# EAGLE design GarageDoorController-v10 (EAGLE 6.1)
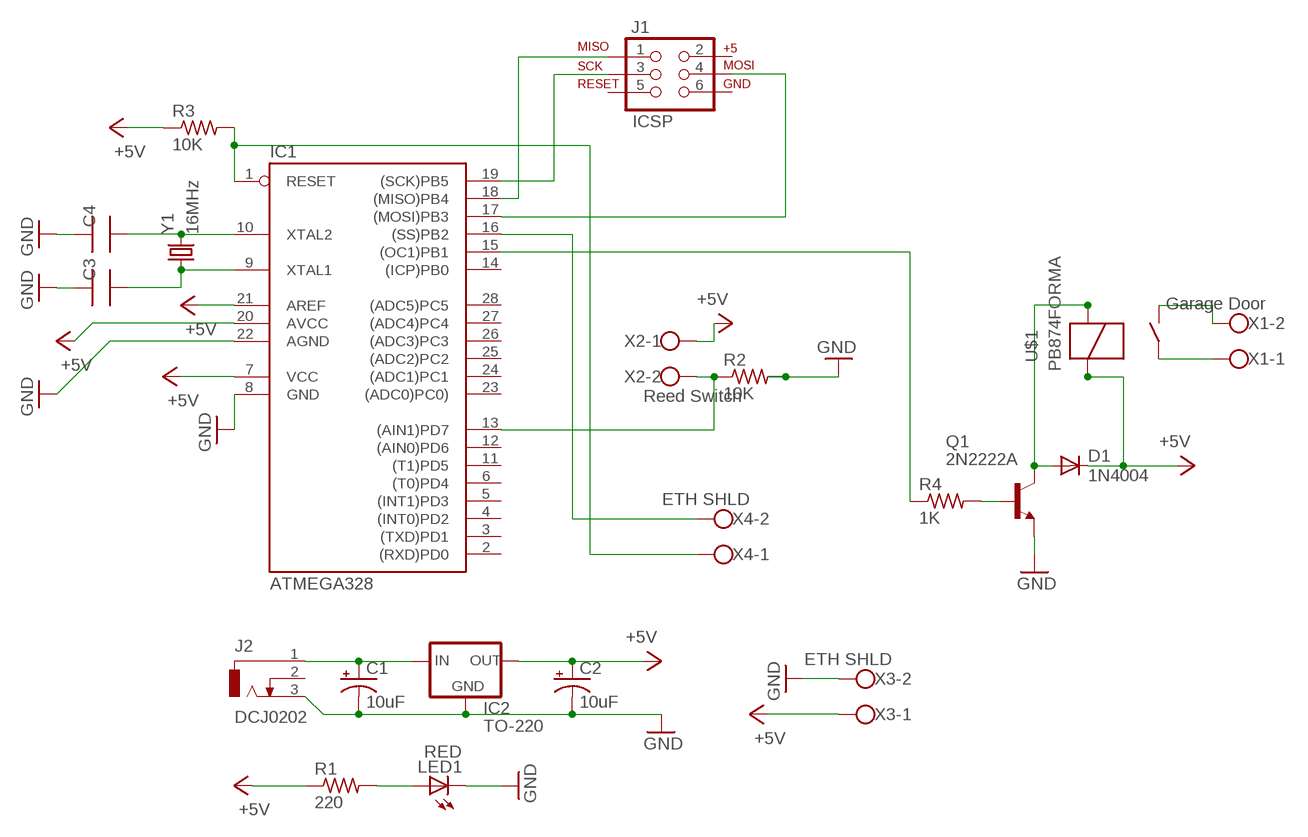
[diagram p0: schematic, sheet 1]

## Parts
C1  10uF  CPOL-USE2-5  [E2-5]
C2  10uF  CPOL-USE2-5  [E2-5]
C3  1440PH  [1440PH]
C4  1440PH  [1440PH]
D1  1N4004  [DO41-10]
IC1  ATMEGA328  AT90S4433P  [DIL28-3]
IC2  TO-220  V_REG_78XX-TO-220  [TO-220-ALT]
J1  ICSP  AVR_SPI_PRG_6PTH  [2X3]
J2  DCJ0202  [DCJ0202]
LED1  RED  LED5MM  [LED5MM]
Q1  2N2222A  [TO18]
R1  220  R-US_0204/7  [0204/7]
R2  10K  R-US_0204/7  [0204/7]
R3  10K  R-US_0204/7  [0204/7]
R4  1K  R-US_0204/7  [0204/7]
U$1  PB874FORMA  [PB874]
X1  Garage Door  W237-102  [W237-102]
X2  Reed Switch  W237-102  [W237-102]
X3  ETH SHLD  W237-102  [W237-102]
X4  ETH SHLD  W237-102  [W237-102]
Y1  16MHz  CRYSTALHC49US  [HC49US]

## Nets
+5V: C2.+ D1.C IC1.7(VCC) IC1.20(AVCC) IC1.21(AREF) IC2.OUT R1.1 R3.1 U$1.2 X2.1 X3.1
GND: C1.- C2.- C3.1 C4.1 IC1.8(GND) IC1.22(AGND) IC2.GND J2.3 LED1.K(C) Q1.1(E) R2.2 X3.2
N$1: C4.2 IC1.10(XTAL2) Y1.2
N$2: C3.2 IC1.9(XTAL1) Y1.1
N$5: C1.+ IC2.IN J2.1
N$6: LED1.A R1.2
N$7: IC1.1(RESET) R3.2 X4.1
N$8: IC1.19((SCK)PB5) J1.3
N$9: IC1.18((MISO)PB4) J1.1
N$10: IC1.17((MOSI)PB3) J1.4
N$11: Q1.2(B) R4.2
N$12: IC1.13((AIN1)PD7) R2.1 X2.2
N$13: D1.A Q1.3(C) U$1.1
N$14: U$1.4 X1.2
N$15: IC1.15((OC1)PB1) R4.1
N$16: U$1.3 X1.1
N$17: IC1.16((SS)PB2) X4.2
Unconnected: IC1.2((RXD)PD0) IC1.3((TXD)PD1) IC1.4((INT0)PD2) IC1.5((INT1)PD3) IC1.6((T0)PD4) IC1.11((T1)PD5) IC1.12((AIN0)PD6) IC1.14((ICP)PB0) IC1.23((ADC0)PC0)) IC1.24((ADC1)PC1) IC1.25((ADC2)PC2) IC1.26((ADC3)PC3) IC1.27((ADC4)PC4) IC1.28((ADC5)PC5) J1.2 J1.5 J1.6 J2.2

## Library data of the parts
C1 C2 = rcl:CPOL-US: POLARIZED CAPACITOR, American symbol
C3 C4 = domiflichi:1440PH: Capacitor Small PTH capacitor - Digikey Part #1440PH
D1 = diode:1N4004: DIODE general purpose rectifier, 1 A
IC1 = atmel:AT90S4433: MICROCONTROLLER 4 Kbytes FLASH 128 bytes SRAM 256 bytes EEPROM UART 6-channel 10 bit ADC; OC_FARNELL: unknown; OC_NEWARK: unknown
IC2 = SparkFun-PowerIC:V_REG_78XX: Voltage Regulator Standard 7805 5V regulator. IGO (Input Ground Output). Spark Fun Electronics SKU : COM-00107
J1 = SparkFun-Connectors:AVR_SPI_PRG_6: AVR ISP 6 Pin This is the reduced ISP connector for AVR programming. Common on Arduino. This footprint will take up less PCB space and can be used with a 10-pin to 6-pin adapter such as SKU: BOB-08508
J2 = con-jack:DCJ0202: DC POWER JACK Source: DCJ0202.pdf; OC_FARNELL: unknown; OC_NEWARK: unknown
LED1 = led:LED: LED OSRAM: - CHIPLED LG R971, LG N971, LY N971, LG Q971, LY Q971, LO R971, LY R971 LH N974, LH R974 LS Q976, LO Q976, LY Q976 LO Q996 - Hyper CHIPLED LW Q18S LB Q993, LB Q99A, LB R99A - SideLED LS A670, LO A670, LY A670, LG A670, LP A670 LB A673, LV A673, LT A673, LW A673 LH A674 LY A675 LS A676, LA A676, LO A676, LY A676, LW A676 LS A679, LY A679, LG A679 - Hyper Micro SIDELED® LS Y876, LA Y876, LO Y876, LY Y876 LT Y87S - SmartLED LW L88C, LW L88S LB L89C, LB L89S, LG L890 LS L89K, LO L89K, LY L89K LS L896, LA L896, LO L896, LY L896 - TOPLED LS T670, LO T670, LY T670, LG T670, LP T670 LSG T670, LSP T670, LSY T670, LOP T670, LYG T670 LG T671, LOG T671, LSG T671 LB T673, LV T673, LT T673, LW T673 LH T674 LS T676, LA T676, LO T676, LY T676, LB T676, LH T676, LSB T676, LW T676 LB T67C, LV T67C, LT T67C, LS T67K, LO T67K, LY T67K, LW E67C LS E67B, LA E67B, LO E67B, LY E67B, LB E67C, LV E67C, LT E67C LW T67C LS T679, LY T679, LG T679 LS T770, LO T770, LY T770, LG T770, LP T770 LB T773, LV T773, LT T773, LW T773 LH T774 LS E675, LA E675, LY E675, LS T675 LS T776, LA T776, LO T776, LY T776, LB T776 LHGB T686 LT T68C, LB T68C - Hyper Mini TOPLED® LB M676 - Mini TOPLED Santana® LG M470 LS M47K, LO M47K, LY M47K Source: http://www.osram.convergy.de LUXEON: - LUMILED® LXK2-PW12-R00, LXK2-PW12-S00, LXK2-PW14-U00, LXK2-PW14-V00 LXK2-PM12-R00, LXK2-PM12-S00, LXK2-PM14-U00 LXK2-PE12-Q00, LXK2-PE12-R00, LXK2-PE12-S00, LXK2-PE14-T00, LXK2-PE14-U00 LXK2-PB12-K00, LXK2-PB12-L00, LXK2-PB12-M00, LXK2-PB14-N00, LXK2-PB14-P00, LXK2-PB14-Q00 LXK2-PR12-L00, LXK2-PR12-M00, LXK2-PR14-Q00, LXK2-PR14-R00 LXK2-PD12-Q00, LXK2-PD12-R00, LXK2-PD12-S00 LXK2-PH12-R00, LXK2-PH12-S00 LXK2-PL12-P00, LXK2-PL12-Q00, LXK2-PL12-R00 Source: www.luxeon.com KINGBRIGHT: KA-3528ASYC Source: www.kingbright.com
Q1 = transistor-npn:2N2222*: NPN Transistor
R1-R4 = resistor:R-US_: RESISTOR, American symbol
U$1 = domiflichi:PB874: Tyco Electronics OJE-SH-105DM (Digi Key Part#PB874) SPST-NO 1 Form A miniature PC Board Relay
X1-X4 = con-wago-500:W237-102: WAGO SCREW CLAMP; MPN: 237-102; OC_FARNELL: unknown; OC_NEWARK: 70K9898
Y1 = SparkFun-FreqCtrl:CRYSTAL: Various standard crystals. Proven footprints. Spark Fun Electronics SKU : COM-00534

## Board
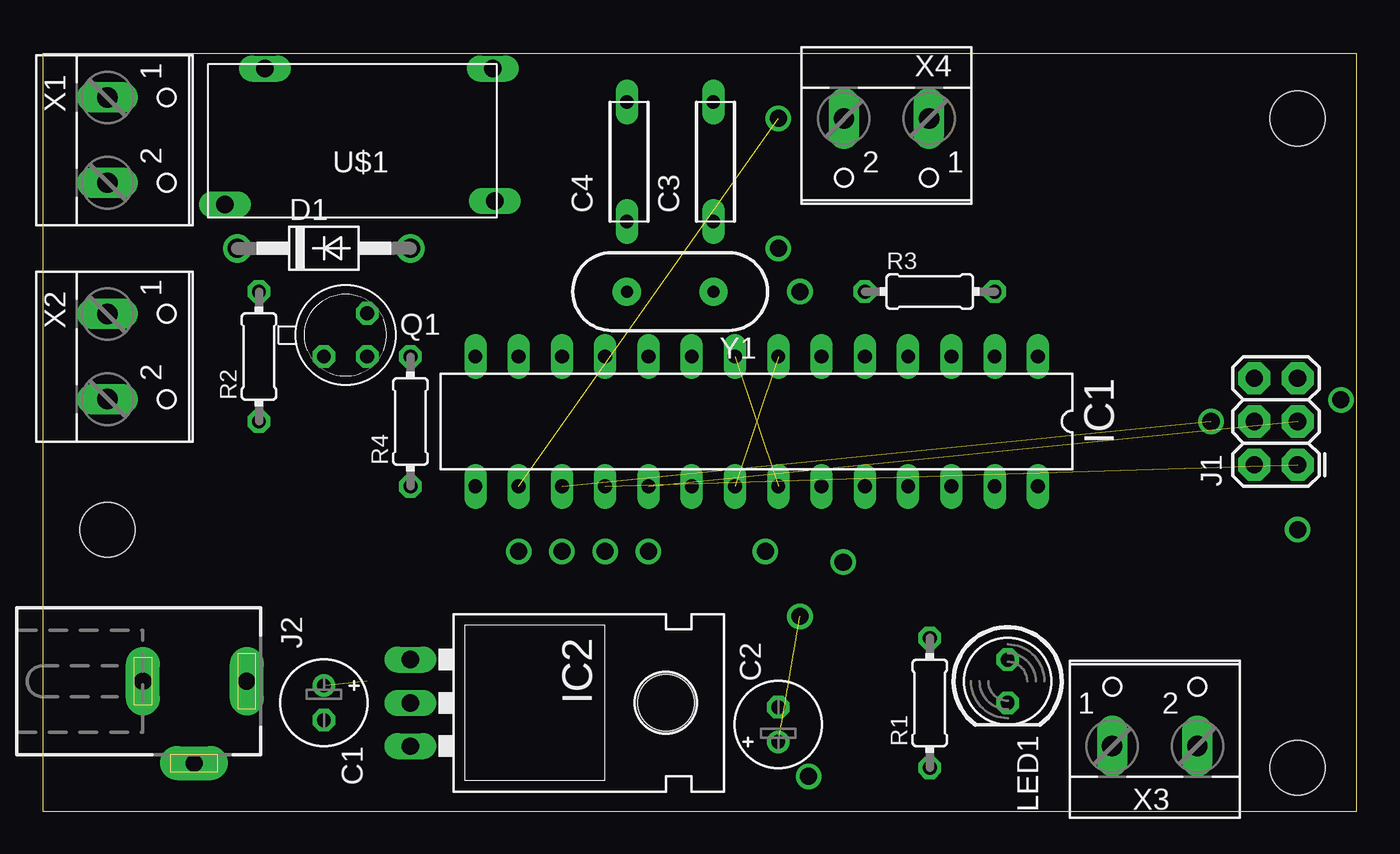
[diagram p1: board, top side]
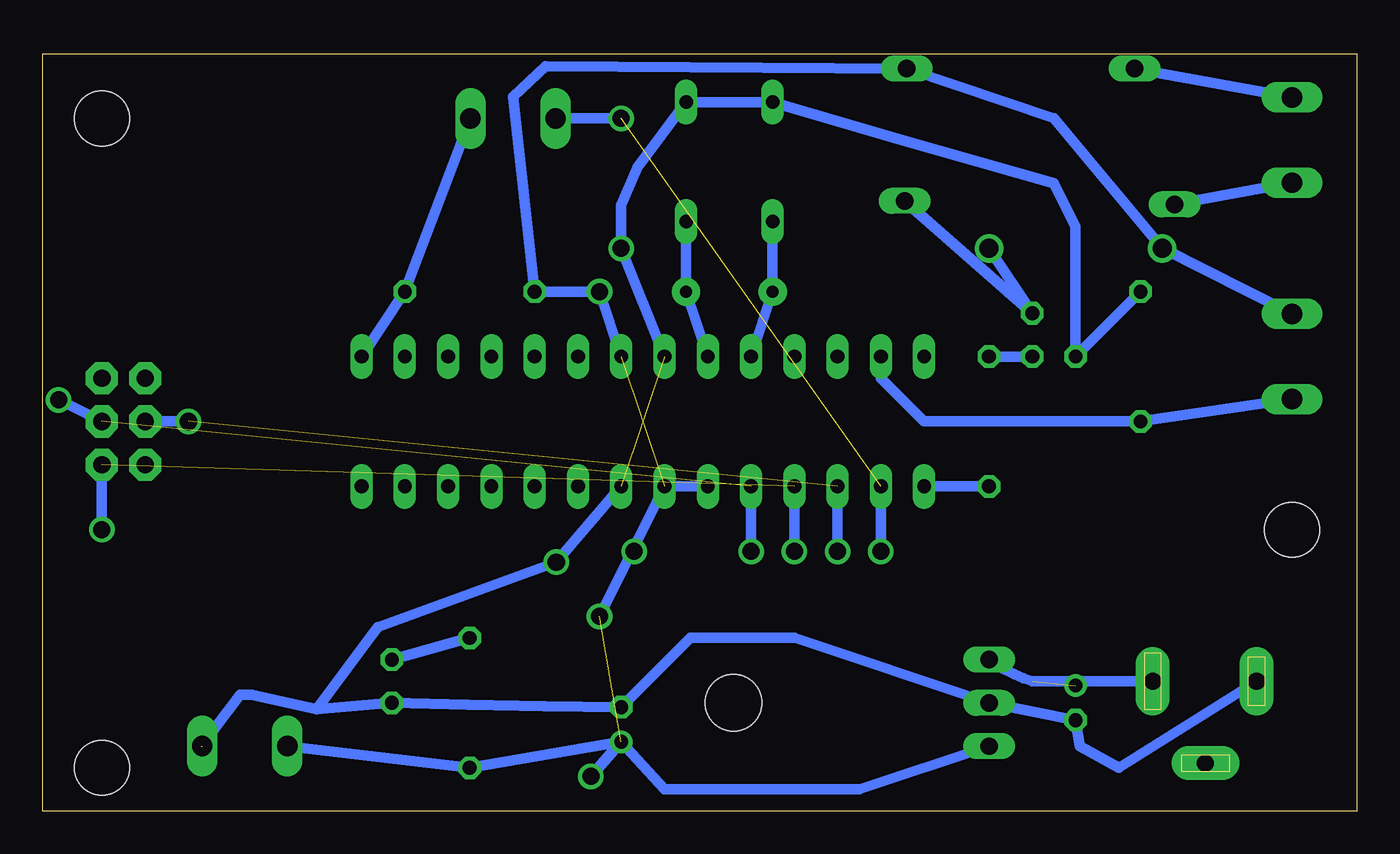
[diagram p2: board, bottom side, seen from below]

Size 77.14 x 44.44 mm. Coordinates in mm from the lower left corner, seen from the top.
Outline: 0,0 77.14,0 77.14,44.44 0,44.44 0,0
Copper layers (1*16): Top 0.035mm / dielectric 1.5mm / Bottom 0.035mm
Design rules: minimum track width 10mil, minimum drill 24mil, track to track 8mil, track to pad 8mil, pad to pad 8mil, via to via 8mil, smd to smd 8mil, copper to edge 40mil, drill to drill 8mil, minimum pad ring 10mil, minimum via ring 8mil, stop-mask expansion 4mil, vias tented up to drill 0mil, thermal gap 10mil
Holes 3.2 mm at 73.66,40.64 73.66,2.54 3.81,16.51

### Footprints (pad centres in the part's own frame; a part is rotated, then mirrored left to right if it is on the bottom)
E2-5 = drill 0.813 pad 1.27: + -1.016,0 | drill 0.813 pad 1.27 octagon: - 1.016,0
1440PH = drill 0.8 long: 1 0,3.5; 2 0,-3.5
DO41-10 = drill 1.118: A 5.08,0; C -5.08,0
DIL28-3 = drill 0.813 long: 1 -16.51,-3.81; 2 -13.97,-3.81; 3 -11.43,-3.81; 4 -8.89,-3.81; 5 -6.35,-3.81; 6 -3.81,-3.81; 7 -1.27,-3.81; 8 1.27,-3.81; 9 3.81,-3.81; 10 6.35,-3.81; 11 8.89,-3.81; 12 11.43,-3.81; 13 13.97,-3.81; 14 16.51,-3.81; 15 16.51,3.81; 16 13.97,3.81; 17 11.43,3.81; 18 8.89,3.81; 19 6.35,3.81; 20 3.81,3.81; 21 1.27,3.81; 22 -1.27,3.81; 23 -3.81,3.81; 24 -6.35,3.81; 25 -8.89,3.81; 26 -11.43,3.81; 27 -13.97,3.81; 28 -16.51,3.81
TO-220-ALT = drill 1.016 long: GND 0,-3.81; IN -2.54,-3.81; OUT 2.54,-3.81 | hole 3.302: 0,11.176
2X3 = drill 1.016 pad 1.88 octagon: 1 0,0; 2 0,2.54; 3 2.54,0; 4 2.54,2.54; 5 5.08,0; 6 5.08,2.54
DCJ0202 = drill 1 pad 2 long: 1 0,3.1; 2 4.8,0; 3 0,-3
LED5MM = drill 0.813 octagon: A -1.27,0; K 1.27,0
TO18 = drill 0.813 octagon: 1 -1.27,-1.27; 2 1.27,-1.27; 3 1.27,1.27
0204/7 = drill 0.813 octagon: 1 -3.81,0; 2 3.81,0
PB874 = drill 1.016 long: 1 0.123,8.019; 2 0.25,0.25; 3 13.614,0.25; 4 15.966,8.222
W237-102 = drill 1.194 long: 1 -2.5,-1.27; 2 2.5,-1.27
HC49US = drill 0.7 pad 1.651: 1 -2.54,0; 2 2.54,0

### Placement (x,y rotation side)
C1  16.51,6.35 270 top
C2  43.18,5.08 90 top
C3  39.37,38.1 0 top
C4  34.29,38.1 0 top
D1  16.51,33.02 0 top
IC1  41.91,22.86 180 top
IC2  25.4,6.35 270 top
J1  73.66,20.32 90 top
J2  8.89,7.62 270 top
LED1  56.64,7.62 270 top
Q1  17.78,27.94 0 top
R1  52.07,6.35 90 top
R2  12.7,26.67 90 top
R3  52.07,30.48 0 top
R4  21.59,22.86 90 top
U$1  26.67,43.81 180 top
X1  5.08,39.37 270 top
X2  5.08,26.67 270 top
X3  65.28,5.08 0 top
X4  49.53,39.37 180 top
Y1  36.83,30.48 180 top

### Tracks (layer width: path | path; a pad name or v marks a point on that pad's centre or on a via)
+5V  (via drill 1)  (2 unrouted)
  Bottom 0.61: X3.1 R1.1 C2.+ | IC2.OUT 29.21,1.27 40.64,1.27 C2.+ | X2.1 D1.C 17.78,40.64 U$1.2 47.62,43.69 49.53,41.91 R3.1 v44.45,30.48 IC1.7 | IC1.20 IC1.21 44.45,11.43 | C2.+ 44.96,2.03
GND  (via drill 1)  (2 unrouted)
  Bottom 0.61: J2.3 13.97,2.54 16.26,3.81 C1.- IC2.GND 33.02,10.16 39.12,10.16 C2.- arc1 LED1.K 61.05,5.97 | 61.05,5.97 64.87,6.84 65.55,6.84 67.82,3.81 | R2.2 Q1.1 16.51,34.29 17.78,36.83 26.67,39.37 C4.1 C3.1 42.22,37.79 43.18,35.56 v43.18,33.02 IC1.8 | IC1.22 v46.99,14.61 57.49,10.79 61.05,5.97
N$1
  Bottom 0.61: IC1.10 Y1.2 C4.2
N$2
  Bottom 0.61: IC1.9 Y1.1 C3.2
N$3  (via drill 1)
  other vias: 44.45,11.43
N$4  (via drill 1)
  other vias: 27.94,15.24
N$5  (1 unrouted)
  Bottom 0.61: J2.1 19.05,7.62 arc19 IC2.IN
N$6
  Bottom 0.61: R1.2 LED1.A
N$7
  Bottom 0.61: X4.1 R3.2 IC1.1
N$8  (1 unrouted)
  Bottom 0.61: J1.3 76.2,24.13 | IC1.19 35.56,15.24
N$9  (1 unrouted)
  Bottom 0.61: J1.1 73.66,16.51 | IC1.18 33.02,15.24
N$10  (1 unrouted)
  Bottom 0.61: J1.4 68.58,22.86 | IC1.17 30.48,15.24
N$11
  Bottom 0.61: Q1.2 R4.2
N$12
  Bottom 0.61: X2.2 R2.1 25.4,22.86 27.94,25.4 IC1.13
N$13
  Bottom 0.61: D1.A Q1.3 U$1.1
N$14
  Bottom 0.61: X1.2 U$1.4
N$15
  Bottom 0.61: R4.1 IC1.15
N$16
  Bottom 0.61: X1.1 U$1.3
N$17  (1 unrouted)
  Bottom 0.61: IC1.16 27.94,15.24 | X4.2 43.18,40.64
N$18  (via drill 1)
  other vias: 30.48,15.24
N$19  (via drill 1)
  other vias: 33.02,15.24
N$20  (via drill 1)
  other vias: 35.56,15.24
N$21  (via drill 1)
  other vias: 42.42,15.24
N$22  (via drill 1)
  other vias: 73.66,16.51
N$23  (via drill 1)
  other vias: 68.58,22.86
N$24  (via drill 1)
  other vias: 76.2,24.13
N$25  (via drill 1)
  other vias: 43.18,40.64
N$26  (via drill 1)
  other vias: 44.96,2.03

### Text on the board
tValues: GDC v1.0 | JamieNerd.blogspot.com